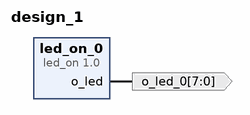
[diagram p0: block diagram of the top level]
# Vivado block design design_1, xc7z010clg400-1, Vivado 2023.2
create_bd_design design_1

create_bd_port -dir O -from 7 -to 0 -type data o_led_0

create_bd_cell -type ip -vlnv xilinx.com:hls:led_on:1.0 led_on_0

# ---- connections ----

connect_bd_net [get_bd_pins led_on_0/o_led] [get_bd_ports o_led_0]

validate_bd_design
save_bd_design
